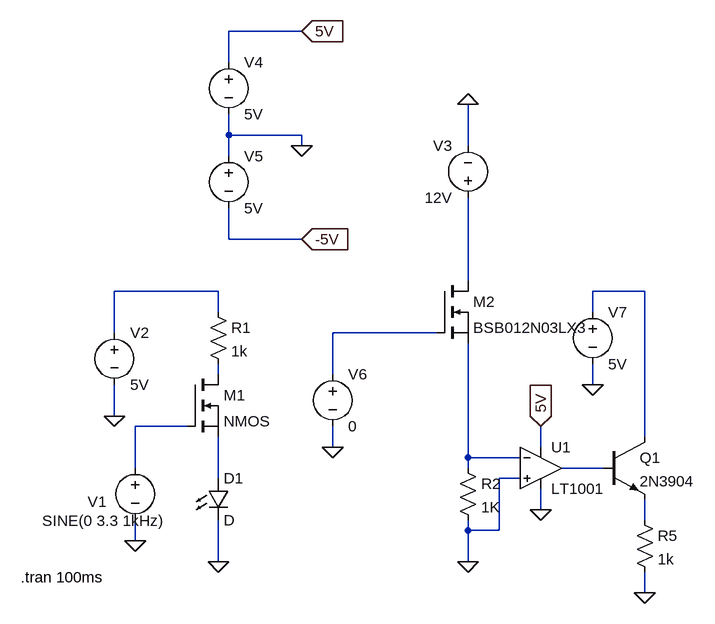
[diagram p0: schematic Current Sensing Detect.asc]
Current Sensing Detect.asc, the LTspice schematic file:
Version 4
SHEET 1 1172 1220
WIRE 336 -432 224 -432
WIRE 224 -384 224 -432
WIRE 224 -272 224 -304
WIRE 336 -272 224 -272
WIRE 336 -256 336 -272
WIRE 592 -256 592 -320
WIRE 224 -240 224 -272
WIRE 224 -112 224 -160
WIRE 336 -112 224 -112
WIRE 592 -48 592 -176
WIRE 208 -32 48 -32
WIRE 864 -32 784 -32
WIRE 208 0 208 -32
WIRE 784 0 784 -32
WIRE 48 32 48 -32
WIRE 544 32 384 32
WIRE 208 96 208 80
WIRE 384 96 384 32
WIRE 784 112 784 80
WIRE 48 160 48 112
WIRE 160 176 80 176
WIRE 864 192 864 -32
WIRE 384 208 384 176
WIRE 704 208 704 176
WIRE 592 224 592 48
WIRE 672 224 592 224
WIRE 80 240 80 176
WIRE 592 240 592 224
WIRE 800 240 736 240
WIRE 208 256 208 192
WIRE 672 256 640 256
WIRE 704 304 704 272
WIRE 864 320 864 288
WIRE 592 336 592 320
WIRE 640 336 640 256
WIRE 640 336 592 336
WIRE 80 352 80 320
WIRE 208 384 208 320
WIRE 592 384 592 336
WIRE 864 432 864 400
FLAG 80 352 0
FLAG 48 160 0
FLAG 208 384 0
FLAG 592 -320 0
FLAG 336 -256 0
FLAG 336 -432 5V
IOPIN 336 -432 In
FLAG 336 -112 -5V
IOPIN 336 -112 In
FLAG 704 176 5V
IOPIN 704 176 In
FLAG 592 384 0
FLAG 384 208 0
FLAG 784 112 0
FLAG 864 432 0
FLAG 704 304 0
SYMBOL nmos 160 96 R0
SYMATTR InstName M1
SYMBOL voltage 80 224 R0
WINDOW 0 -73 68 Left 2
WINDOW 3 -143 97 Left 2
WINDOW 123 0 0 Left 0
WINDOW 39 0 0 Left 0
SYMATTR InstName V1
SYMATTR Value SINE(0 3.3 1kHz)
SYMBOL voltage 48 16 R0
SYMATTR InstName V2
SYMATTR Value 5V
SYMBOL LED 192 256 R0
SYMATTR InstName D1
SYMBOL res 192 -16 R0
SYMATTR InstName R1
SYMATTR Value 1k
SYMBOL OpAmps\\LT1001 704 176 R0
SYMATTR InstName U1
SYMBOL voltage 592 -160 R180
WINDOW 0 24 96 Left 2
WINDOW 3 24 16 Left 2
SYMATTR InstName V3
SYMATTR Value 12V
SYMBOL res 576 224 R0
SYMATTR InstName R2
SYMATTR Value 1K
SYMBOL voltage 224 -400 R0
SYMATTR InstName V4
SYMATTR Value 5V
SYMBOL voltage 224 -256 R0
SYMATTR InstName V5
SYMATTR Value 5V
SYMBOL nmos 544 -48 R0
SYMATTR InstName M2
SYMATTR Value BSB012N03LX3
SYMBOL voltage 384 80 R0
SYMATTR InstName V6
SYMATTR Value 0
SYMBOL npn 800 192 R0
SYMATTR InstName Q1
SYMATTR Value 2N3904
SYMBOL voltage 784 -16 R0
SYMATTR InstName V7
SYMATTR Value 5V
SYMBOL res 848 304 R0
SYMATTR InstName R5
SYMATTR Value 1k
TEXT -96 408 Left 2 !.tran 100ms

The netlist it stands for:
* Current Sensing Detect.asc
M1 N005 N006 N009 N009 NMOS
V1 N006 0 SINE(0 3.3 1kHz)
V2 N002 0 5V
D1 N009 0 D
R1 N002 N005 1k
XU1 0 N007 5V 0 N008 LT1001  ; pins In+ In- V+ V- OUT
V3 N001 0 12V
R2 N007 0 1K
V4 5V 0 5V
V5 0 -5V 5V
M2 N001 N004 N007 N007 BSB012N03LX3
V6 N004 0 0
Q1 N003 N008 N010 0 2N3904
V7 N003 0 5V
R5 N010 0 1k
.model D D
.lib standard.dio
.model NPN NPN
.model PNP PNP
.lib standard.bjt
.model NMOS NMOS
.model PMOS PMOS
.lib standard.mos
.tran 100ms
.lib LTC.lib
.backanno
.end